# EAGLE schematic led_3_layer_badge (EAGLE 6.1)
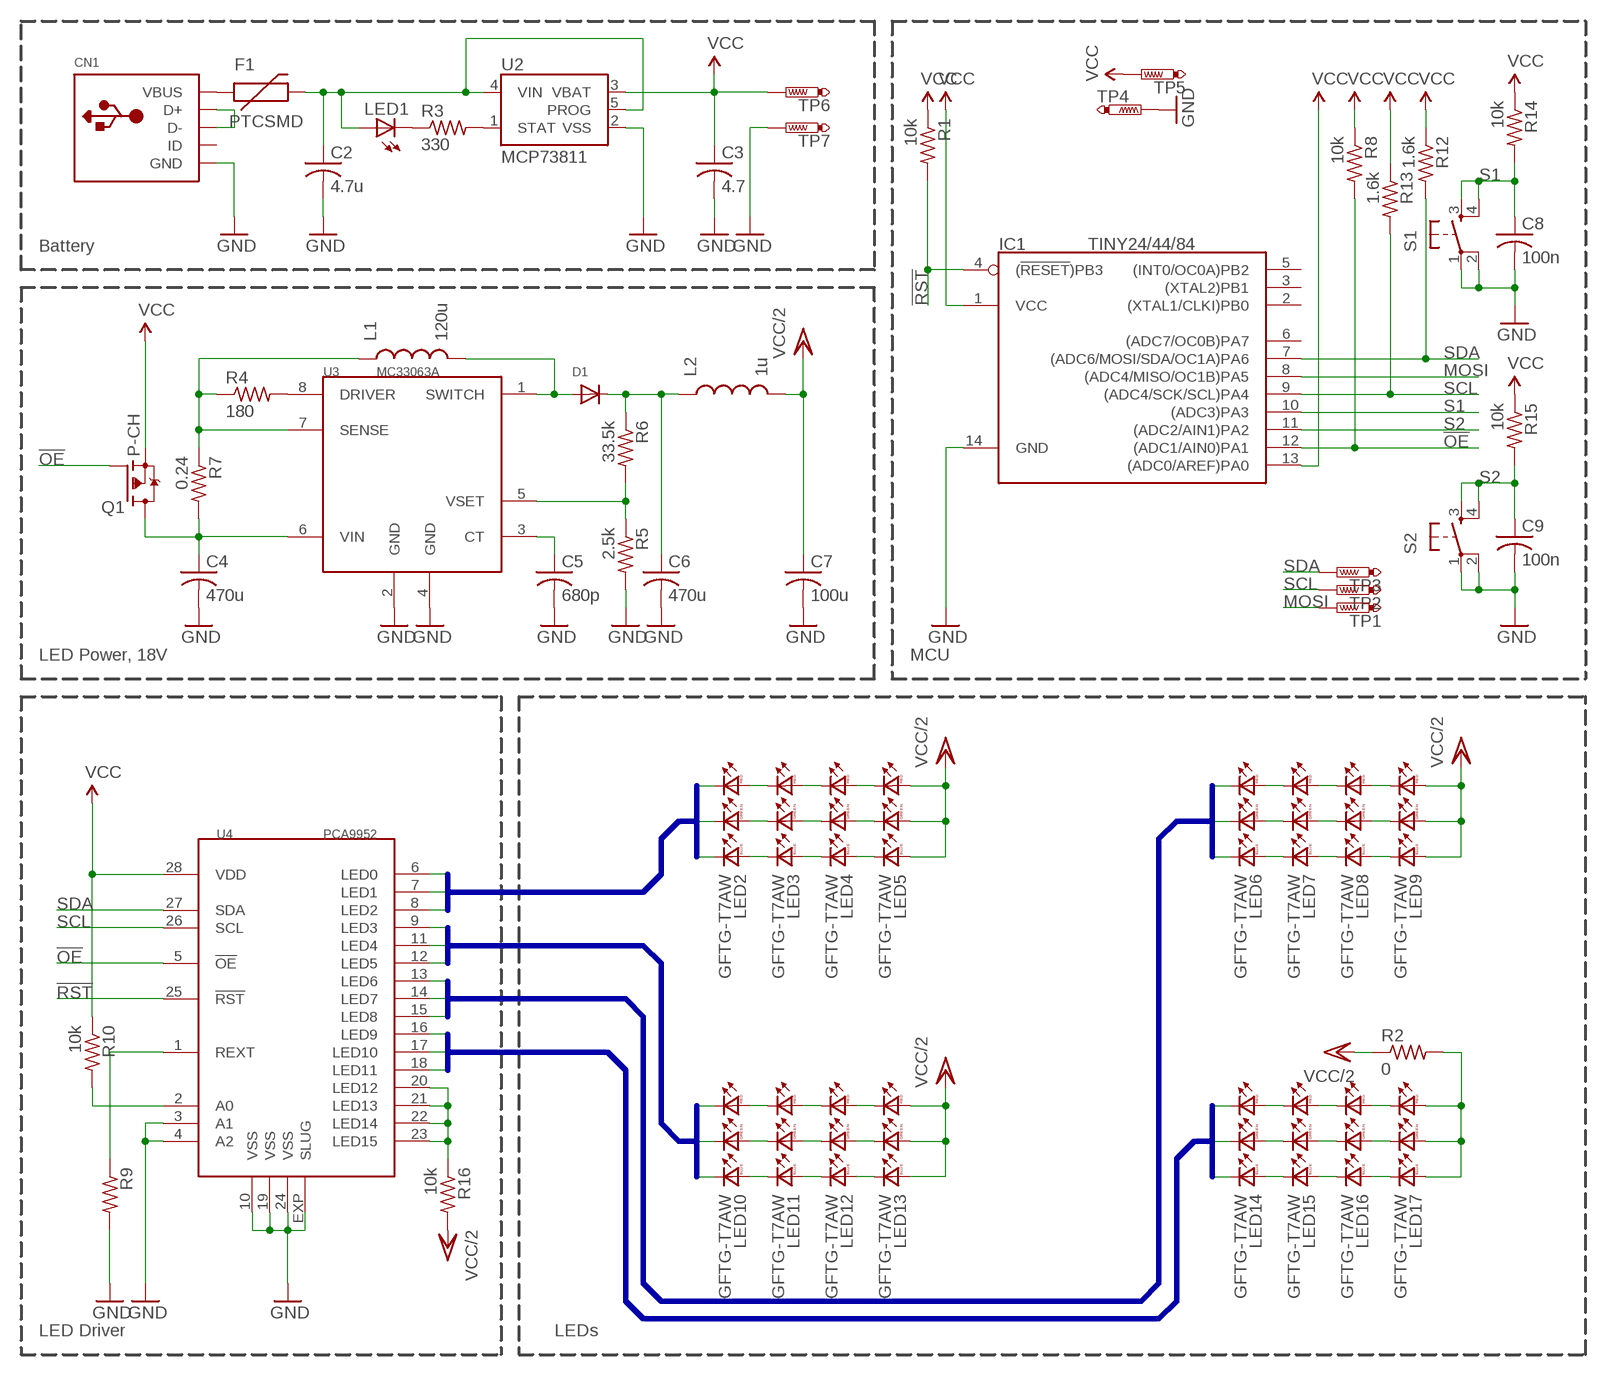
[diagram p0: schematic, sheet 1]

## Parts
C2  4.7u  C-USC1206  [C1206]
C3  4.7  C-USC1206  [C1206]
C4  470u  C-USC1206  [C1206]
C5  680p  C-USC1206  [C1206]
C6  470u  C-USC1206  [C1206]
C7  100u  C-USC1206  [C1206]
C8  100n  C-USC1206  [C1206]
C9  100n  C-USC1206  [C1206]
CN1  USBMINIB  [USB-MINIB]
D1  DIODESMA  [SMADIODE]
F1  PTCSMD  [PTC-1206]
IC1  TINY24/44/84  [SOIC14]
L1  120u  INDUCTOR1206H*  [INDUCTOR-1206]
L2  1u  INDUCTOR1206H*  [INDUCTOR-1206]
LED1  LEDSMT1206  [1206]
LED2  GFTG-T7AW  [C63062-A4-7-A1-01]
LED3  GFTG-T7AW  [C63062-A4-7-A1-01]
LED4  GFTG-T7AW  [C63062-A4-7-A1-01]
LED5  GFTG-T7AW  [C63062-A4-7-A1-01]
LED6  GFTG-T7AW  [C63062-A4-7-A1-01]
LED7  GFTG-T7AW  [C63062-A4-7-A1-01]
LED8  GFTG-T7AW  [C63062-A4-7-A1-01]
LED9  GFTG-T7AW  [C63062-A4-7-A1-01]
LED10  GFTG-T7AW  [C63062-A4-7-A1-01]
LED11  GFTG-T7AW  [C63062-A4-7-A1-01]
LED12  GFTG-T7AW  [C63062-A4-7-A1-01]
LED13  GFTG-T7AW  [C63062-A4-7-A1-01]
LED14  GFTG-T7AW  [C63062-A4-7-A1-01]
LED15  GFTG-T7AW  [C63062-A4-7-A1-01]
LED16  GFTG-T7AW  [C63062-A4-7-A1-01]
LED17  GFTG-T7AW  [C63062-A4-7-A1-01]
Q1  P-CH  TRANSISTOR_FET_TSM2301CX  [SOT-23]
R1  10k  R-US_R1206  [R1206]
R2  0  R-US_R1206  [R1206]
R3  330  R-US_R1206  [R1206]
R4  180  R-US_R1206  [R1206]
R5  2.5k  R-US_R1206  [R1206]
R6  33.5k  R-US_R1206  [R1206]
R7  0.24  R-US_R1206  [R1206]
R8  10k  R-US_R1206  [R1206]
R9  R-US_R1206  [R1206]
R10  10k  R-US_R1206  [R1206]
R12  1.6k  R-US_R1206  [R1206]
R13  1.6k  R-US_R1206  [R1206]
R14  10k  R-US_R1206  [R1206]
R15  10k  R-US_R1206  [R1206]
R16  10k  R-US_R1206  [R1206]
S1  TAC_SWITCHSMD  [TACTILE_SWITCH_SMD]
S2  TAC_SWITCHSMD  [TACTILE_SWITCH_SMD]
TP1  PTR1TP13R  [TP13R]
TP2  PTR1TP13R  [TP13R]
TP3  PTR1TP13R  [TP13R]
TP4  PTR1TP13R  [TP13R]
TP5  PTR1TP13R  [TP13R]
TP6  PTR1B2,54  [B2,54]
TP7  PTR1B2,54  [B2,54]
U2  MCP73811  MCP73831  [SOT23-5]
U3  MC33063A  AP34063  [SOP-8]
U4  PCA9952  [HTSSOP28]

## Nets
!OE: IC1.12((ADC1/AIN0)PA1) Q1.1(G) R8.2 U4.5(!OE)
!RST: IC1.4((!RESET!)PB3) R1.2 U4.25(!RST)
A0: LED2.C3(RC) U4.6(LED0)
A1: LED2.C2(GC) U4.7(LED1)
A2: LED2.C1(BC) U4.8(LED2)
B0: LED10.C3(RC) U4.9(LED3)
B1: LED10.C2(GC) U4.11(LED4)
B2: LED10.C1(BC) U4.12(LED5)
C0: LED6.C3(RC) U4.13(LED6)
C1: LED6.C2(GC) U4.14(LED7)
C2: LED6.C1(BC) U4.15(LED8)
D0: LED14.C3(RC) U4.16(LED9)
D1: LED14.C2(GC) U4.17(LED10)
D2: LED14.C1(BC) U4.18(LED11)
GND: C2.2 C3.2 C4.2 C5.2 C6.2 C7.2 C8.2 C9.2 CN1.GND IC1.14(GND) R5.2 R9.2 S1.1 S1.2 S2.1 S2.2 TP4.TP TP7.TP U2.2(VSS) U3.2(GND) U3.4(GND) U4.3(A1) U4.4(A2) U4.10(VSS) U4.19(VSS) U4.24(VSS) U4.EXP(SLUG)
MOSI: IC1.8((ADC4/MISO/OC1B)PA5) TP1.TP
N$1: CN1.VBUS F1.1
N$2: LED2.A1(BA) LED3.C1(BC)
N$3: R9.1 U4.1(REXT)
N$4: LED1.C R3.1
N$5: R3.2 U2.1(STAT)
N$6: C2.1 F1.2 LED1.A U2.4(VIN) U2.5(PROG)
N$7: C4.1 Q1.3(D) R7.2 U3.6(VIN)
N$8: C5.1 U3.3(CT)
N$9: D1.A L1.P$2 U3.1(SWITCH)
N$10: LED17.A1(BA) LED17.A2(GA) LED17.A3(RA) R2.2
N$11: R5.1 R6.2 U3.5(VSET)
N$12: LED6.A1(BA) LED7.C1(BC)
N$13: L1.P$1 R4.1 R7.1 U3.7(SENSE)
N$14: R4.2 U3.8(DRIVER)
N$15: C6.1 D1.C L2.P$1 R6.1
N$16: LED6.A2(GA) LED7.C2(GC)
N$17: LED6.A3(RA) LED7.C3(RC)
N$18: LED7.A1(BA) LED8.C1(BC)
N$19: LED7.A2(GA) LED8.C2(GC)
N$20: LED7.A3(RA) LED8.C3(RC)
N$21: LED8.A1(BA) LED9.C1(BC)
N$22: LED8.A2(GA) LED9.C2(GC)
N$23: R16.1 U4.20(LED12) U4.21(LED13) U4.22(LED14) U4.23(LED15)
N$24: LED2.A2(GA) LED3.C2(GC)
N$25: LED2.A3(RA) LED3.C3(RC)
N$26: CN1.D+ CN1.D-
N$27: R10.2 U4.2(A0)
N$28: LED3.A1(BA) LED4.C1(BC)
N$29: LED3.A2(GA) LED4.C2(GC)
N$30: LED3.A3(RA) LED4.C3(RC)
N$31: LED4.A1(BA) LED5.C1(BC)
N$32: LED4.A2(GA) LED5.C2(GC)
N$33: LED4.A3(RA) LED5.C3(RC)
N$34: LED8.A3(RA) LED9.C3(RC)
N$35: LED10.A1(BA) LED11.C1(BC)
N$36: LED10.A2(GA) LED11.C2(GC)
N$37: LED10.A3(RA) LED11.C3(RC)
N$38: LED11.A1(BA) LED12.C1(BC)
N$39: LED11.A2(GA) LED12.C2(GC)
N$40: LED11.A3(RA) LED12.C3(RC)
N$41: LED12.A1(BA) LED13.C1(BC)
N$42: LED12.A2(GA) LED13.C2(GC)
N$43: LED12.A3(RA) LED13.C3(RC)
N$44: LED14.A1(BA) LED15.C1(BC)
N$45: LED14.A2(GA) LED15.C2(GC)
N$46: LED14.A3(RA) LED15.C3(RC)
N$47: LED15.A1(BA) LED16.C1(BC)
N$48: LED15.A2(GA) LED16.C2(GC)
N$49: LED15.A3(RA) LED16.C3(RC)
N$50: LED16.A1(BA) LED17.C1(BC)
N$51: LED16.A2(GA) LED17.C2(GC)
N$52: LED16.A3(RA) LED17.C3(RC)
S1: C8.1 IC1.10((ADC3)PA3) R14.2 S1.3 S1.4
S2: C9.1 IC1.11((ADC2/AIN1)PA2) R15.2 S2.3 S2.4
SCL: IC1.9((ADC4/SCK/SCL)PA4) R13.2 TP2.TP U4.26(SCL)
SDA: IC1.7((ADC6/MOSI/SDA/OC1A)PA6) R12.2 TP3.TP U4.27(SDA)
VCC: C3.1 IC1.1(VCC) IC1.13((ADC0/AREF)PA0) Q1.2(S) R1.1 R8.1 R10.1 R12.1 R13.1 R14.1 R15.1 TP5.TP TP6.TP U2.3(VBAT) U4.28(VDD)
VCC/2: C7.1 L2.P$2 LED5.A1(BA) LED5.A2(GA) LED5.A3(RA) LED9.A1(BA) LED9.A2(GA) LED9.A3(RA) LED13.A1(BA) LED13.A2(GA) LED13.A3(RA) R2.1 R16.2
Unconnected: CN1.ID IC1.2((XTAL1/CLKI)PB0) IC1.3((XTAL2)PB1) IC1.5((INT0/OC0A)PB2) IC1.6((ADC7/OC0B)PA7)

## Buses
A[0..2]
B[0..2]
C[0..2]
D[0..2]

## Notes on the sheet
- Battery
- LED Power, 18V | MCU
- LED Driver | LEDs

## Library data of the parts
C2-C9 = adafruit:C-US: CAPACITOR, American symbol
CN1 = adafruit:USB: USB Connectors USBMINIB - Surface Mount Female Mini-B USB Connector 4UConnector: 06564 By microbuilder.eu Thru-hole RA Female Mini-B USB Connector 4UConnector: 18732 By ladyada.net
D1 = adafruit:DIODE: Diode SMADIODE - SMA Surface Mount Package 20V 1A Schottky Diode Digikey: 641-1014-6-ND DO-1N4148 - Through Hole Small Current Diode SOD-123 20V 1 A (.5mV Vf) Schottky Diode - Digikey: MBRX120TPMSCT-ND SOD-323 10V 570mA (.38mV Vf, 3ns) Schottky Diode - Digikey: ZLLS410CT-ND SOD-523 30V 30mA Schottky Diode (RB751S-40TE61) - Digikey: RB751S-40TE61CT-ND SOT23-R/W - SOT23 Package (R = Solder Paste/Reflow Ovens, W = Hand-Soldering) BAT54Film 40V 300mA - Digikey: 497-7162-1-ND
F1 = sparkfun:PTC: Resettable Fuse PTC Resettable Fuse. Spark Fun Electronics SKU : COM-08357
IC1 = atmel:TINY24/44/84: TINY24/44/84 SOIC-14
L1 L2 = sparkfun:INDUCTOR: Inductors Basic Inductor/Choke - 0603 and 1206. Footprints are not proven and vary greatly between part numbers.
LED1 = adafruit:LED: LED OSRAM: - CHIPLED LG R971, LG N971, LY N971, LG Q971, LY Q971, LO R971, LY R971 LH N974, LH R974 LS Q976, LO Q976, LY Q976 LO Q996 - Hyper CHIPLED LW Q18S LB Q993, LB Q99A, LB R99A - SideLED LS A670, LO A670, LY A670, LG A670, LP A670 LB A673, LV A673, LT A673, LW A673 LH A674 LY A675 LS A676, LA A676, LO A676, LY A676, LW A676 LS A679, LY A679, LG A679 - Hyper Micro SIDELED® LS Y876, LA Y876, LO Y876, LY Y876 LT Y87S - SmartLED LW L88C, LW L88S LB L89C, LB L89S, LG L890 LS L89K, LO L89K, LY L89K LS L896, LA L896, LO L896, LY L896 - TOPLED LS T670, LO T670, LY T670, LG T670, LP T670 LSG T670, LSP T670, LSY T670, LOP T670, LYG T670 LG T671, LOG T671, LSG T671 LB T673, LV T673, LT T673, LW T673 LH T674 LS T676, LA T676, LO T676, LY T676, LB T676, LH T676, LSB T676, LW T676 LB T67C, LV T67C, LT T67C, LS T67K, LO T67K, LY T67K, LW E67C LS E67B, LA E67B, LO E67B, LY E67B, LB E67C, LV E67C, LT E67C LW T67C LS T679, LY T679, LG T679 LS T770, LO T770, LY T770, LG T770, LP T770 LB T773, LV T773, LT T773, LW T773 LH T774 LS E675, LA E675, LY E675, LS T675 LS T776, LA T776, LO T776, LY T776, LB T776 LHGB T686 LT T68C, LB T68C - Hyper Mini TOPLED® LB M676 - Mini TOPLED Santana® LG M470 LS M47K, LO M47K, LY M47K Source: http://www.osram.convergy.de/
LED2-LED17 = osram:GFTG-T7AW: GFTG-T7AW RGB LED
Q1 = dp_devices:TRANSISTOR_FET_TSM2301CX: 20V P-Channel Enhancement Mode MOSFET
R1-R10 R12-R16 = rcl:R-US_: RESISTOR, American symbol
S1 S2 = sparkfun:TAC_SWITCH: Momentary Switch Button commonly used for reset or general input. Spark Fun Electronics SKU : COM-00097
TP1-TP7 = testpad:PTR1: TEST PIN
U2 = sparkfun:MCP73831: Microchip's MCP73831 Miniature single cell, fully integrated Li-Ion, Li-polymer charge management controller http://ww1.microchip.com/downloads/en/DeviceDoc/21984a.pdf
U3 = diodes-inc:AP34063
U4 = nxp:PCA9952: LED driver